# Altium schematic sheet Main.SchDoc
size A; SheetNumber: 1; SheetTotal: 6
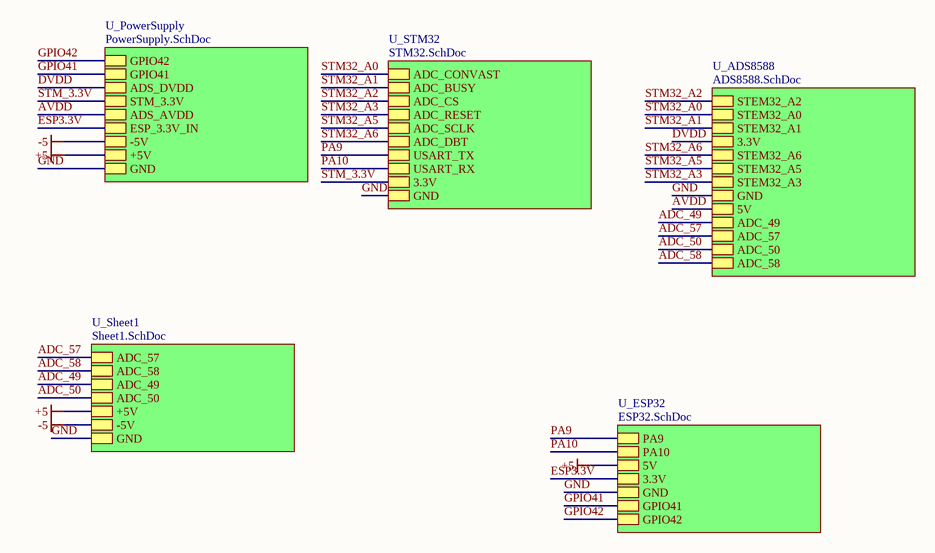
[diagram p0: Main.SchDoc]

## Sub-sheets
U_ADS8588 = ADS8588.SchDoc: STEM32_A2, STEM32_A0, STEM32_A1, 3.3V, STEM32_A6, STEM32_A5, STEM32_A3, GND, 5V, ADC_49, ADC_57, ADC_50, ADC_58
U_ESP32 = ESP32.SchDoc: PA9, PA10, 5V, 3.3V, GND, GPIO41, GPIO42
U_PowerSupply = PowerSupply.SchDoc: GPIO42, GPIO41, ADS_DVDD, STM_3.3V, ADS_AVDD, ESP_3.3V_IN, -5V, +5V, GND
U_Sheet1 = Sheet1.SchDoc: ADC_57, ADC_58, ADC_49, ADC_50, +5V, -5V, GND
U_STM32 = STM32.SchDoc: ADC_CONVAST, ADC_BUSY, ADC_CS, ADC_RESET, ADC_SCLK, ADC_DBT, USART_TX, USART_RX, 3.3V, GND

## Nets
+5: sheet U_PowerSupply/+5V, sheet U_Sheet1/+5V, sheet U_ESP32/5V
-5: sheet U_PowerSupply/-5V, sheet U_Sheet1/-5V
ADC_49: sheet U_Sheet1/ADC_49, sheet U_ADS8588/ADC_49
ADC_50: sheet U_Sheet1/ADC_50, sheet U_ADS8588/ADC_50
ADC_57: sheet U_Sheet1/ADC_57, sheet U_ADS8588/ADC_57
ADC_58: sheet U_Sheet1/ADC_58, sheet U_ADS8588/ADC_58
AVDD: sheet U_PowerSupply/ADS_AVDD, sheet U_ADS8588/5V
DVDD: sheet U_PowerSupply/ADS_DVDD, sheet U_ADS8588/3.3V
ESP3.3V: sheet U_PowerSupply/ESP_3.3V_IN, sheet U_ESP32/3.3V
GND: sheet U_PowerSupply/GND, sheet U_STM32/GND, sheet U_Sheet1/GND, sheet U_ADS8588/GND, sheet U_ESP32/GND
GPIO41: sheet U_PowerSupply/GPIO41, sheet U_ESP32/GPIO41
GPIO42: sheet U_PowerSupply/GPIO42, sheet U_ESP32/GPIO42
PA9: sheet U_STM32/USART_TX, sheet U_ESP32/PA9
PA10: sheet U_STM32/USART_RX, sheet U_ESP32/PA10
STM32_A0: sheet U_STM32/ADC_CONVAST, sheet U_ADS8588/STEM32_A0
STM32_A1: sheet U_STM32/ADC_BUSY, sheet U_ADS8588/STEM32_A1
STM32_A2: sheet U_STM32/ADC_CS, sheet U_ADS8588/STEM32_A2
STM32_A3: sheet U_STM32/ADC_RESET, sheet U_ADS8588/STEM32_A3
STM32_A5: sheet U_STM32/ADC_SCLK, sheet U_ADS8588/STEM32_A5
STM32_A6: sheet U_STM32/ADC_DBT, sheet U_ADS8588/STEM32_A6
STM_3.3V: sheet U_PowerSupply/STM_3.3V, sheet U_STM32/3.3V